# EAGLE design dynalo-dac (EAGLE 8.2.1)
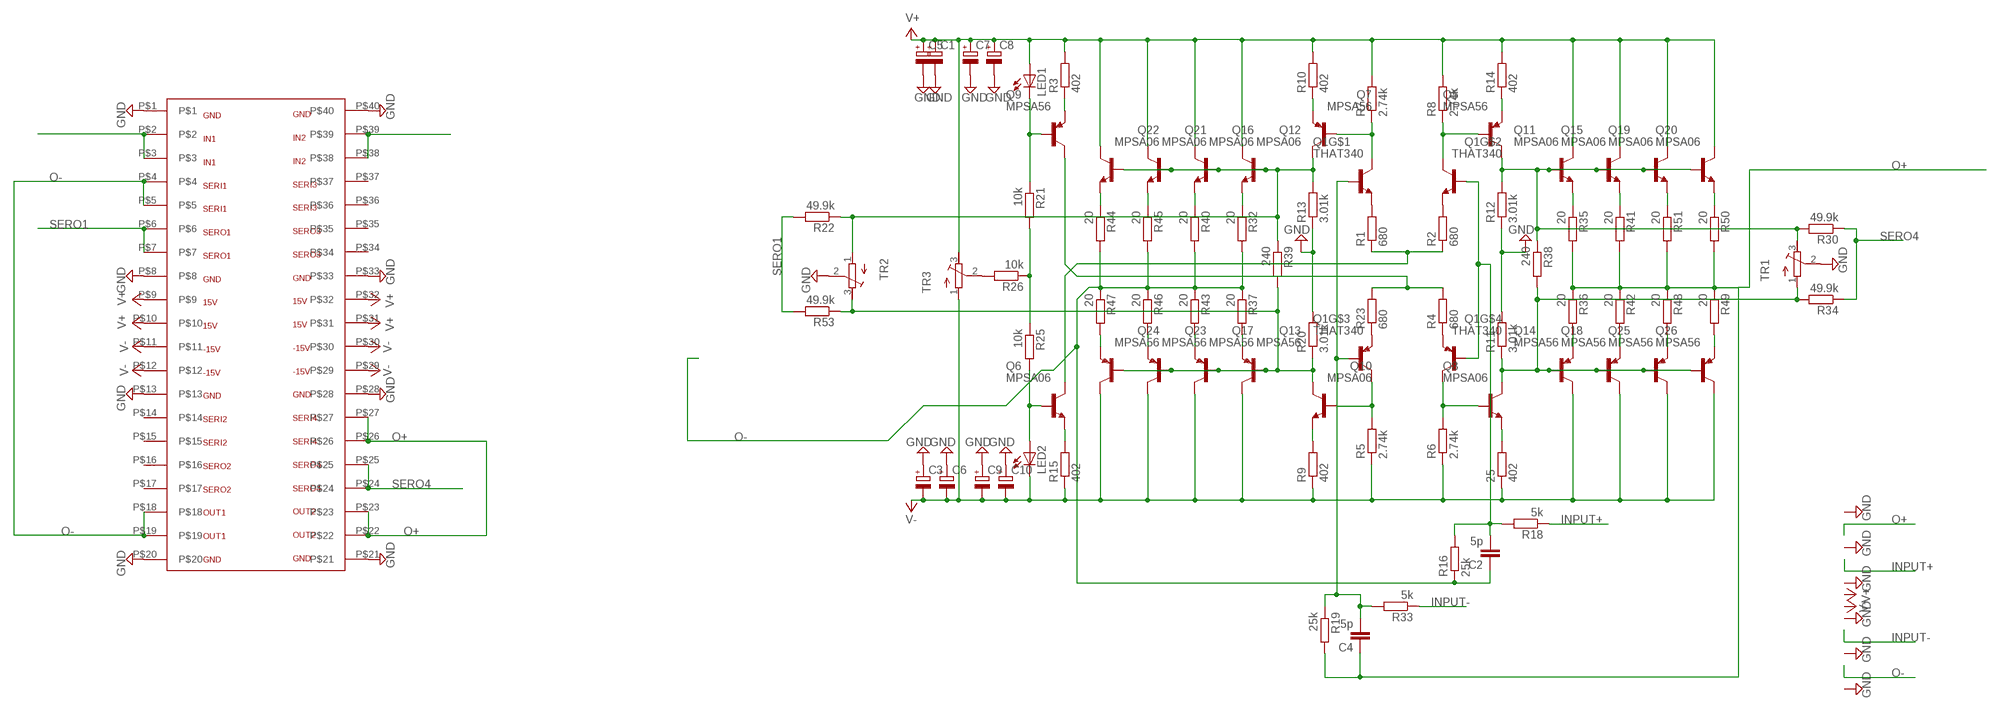
[diagram p0: schematic, sheet 1]

## Parts
25  402  R-EU_MELF0204W  [MINI_MELF-0204W]
C1  CPOL-EUSP-CAP-CX  [SP-CAP-CX]
C2  5p  C-EUC0805  [C0805]
C3  CPOL-EUSP-CAP-CX  [SP-CAP-CX]
C4  5p  C-EUC0805  [C0805]
C5  CPOL-EUSP-CAP-CX  [SP-CAP-CX]
C6  CPOL-EUSP-CAP-CX  [SP-CAP-CX]
C7  CPOL-EUSP-CAP-CX  [SP-CAP-CX]
C8  CPOL-EUSP-CAP-CX  [SP-CAP-CX]
C9  CPOL-EUSP-CAP-CX  [SP-CAP-CX]
C10  CPOL-EUSP-CAP-CX  [SP-CAP-CX]
LED1  LED5MM  [LED5MM]
LED2  LED5MM  [LED5MM]
Q1  THAT340  [DIP254P762X510-14]
Q5  MPSA56  [TO92-BCE]
Q6  MPSA06  [TO92-1]
Q7  MPSA56  [TO92-BCE]
Q8  MPSA06  [TO92-1]
Q9  MPSA56  [TO92-BCE]
Q10  MPSA06  [TO92-1]
Q11  MPSA06  [TO92-1]
Q12  MPSA06  [TO92-1]
Q13  MPSA56  [TO92-BCE]
Q14  MPSA56  [TO92-BCE]
Q15  MPSA06  [TO92-1]
Q16  MPSA06  [TO92-1]
Q17  MPSA56  [TO92-BCE]
Q18  MPSA56  [TO92-BCE]
Q19  MPSA06  [TO92-1]
Q20  MPSA06  [TO92-1]
Q21  MPSA06  [TO92-1]
Q22  MPSA06  [TO92-1]
Q23  MPSA56  [TO92-BCE]
Q24  MPSA56  [TO92-BCE]
Q25  MPSA56  [TO92-BCE]
Q26  MPSA56  [TO92-BCE]
R1  680  R-EU_MELF0204W  [MINI_MELF-0204W]
R2  680  R-EU_MELF0204W  [MINI_MELF-0204W]
R3  402  R-EU_MELF0204W  [MINI_MELF-0204W]
R4  680  R-EU_MELF0204W  [MINI_MELF-0204W]
R5  2.74k  R-EU_MELF0204W  [MINI_MELF-0204W]
R6  2.74k  R-EU_MELF0204W  [MINI_MELF-0204W]
R7  2.74k  R-EU_MELF0204W  [MINI_MELF-0204W]
R8  2.74k  R-EU_MELF0204W  [MINI_MELF-0204W]
R9  402  R-EU_MELF0204W  [MINI_MELF-0204W]
R10  402  R-EU_MELF0204W  [MINI_MELF-0204W]
R11  3.01k  R-EU_MELF0204W  [MINI_MELF-0204W]
R12  3.01k  R-EU_MELF0204W  [MINI_MELF-0204W]
R13  3.01k  R-EU_MELF0204W  [MINI_MELF-0204W]
R14  402  R-EU_MELF0204W  [MINI_MELF-0204W]
R15  402  R-EU_MELF0204W  [MINI_MELF-0204W]
R16  25k  R-EU_MELF0204W  [MINI_MELF-0204W]
R18  5k  R-EU_MELF0204W  [MINI_MELF-0204W]
R19  25k  R-EU_MELF0204W  [MINI_MELF-0204W]
R20  3.01k  R-EU_MELF0204W  [MINI_MELF-0204W]
R21  10k  R-EU_MELF0204W  [MINI_MELF-0204W]
R22  49.9k  R-EU_MELF0204W  [MINI_MELF-0204W]
R23  680  R-EU_MELF0204W  [MINI_MELF-0204W]
R25  10k  R-EU_MELF0204W  [MINI_MELF-0204W]
R26  10k  R-EU_MELF0204W  [MINI_MELF-0204W]
R30  49.9k  R-EU_MELF0204W  [MINI_MELF-0204W]
R32  20  R-EU_MELF0204W  [MINI_MELF-0204W]
R33  5k  R-EU_MELF0204W  [MINI_MELF-0204W]
R34  49.9k  R-EU_MELF0204W  [MINI_MELF-0204W]
R35  20  R-EU_MELF0204W  [MINI_MELF-0204W]
R36  20  R-EU_MELF0204W  [MINI_MELF-0204W]
R37  20  R-EU_MELF0204W  [MINI_MELF-0204W]
R38  240  R-EU_MELF0204W  [MINI_MELF-0204W]
R39  240  R-EU_MELF0204W  [MINI_MELF-0204W]
R40  20  R-EU_MELF0204W  [MINI_MELF-0204W]
R41  20  R-EU_MELF0204W  [MINI_MELF-0204W]
R42  20  R-EU_MELF0204W  [MINI_MELF-0204W]
R43  20  R-EU_MELF0204W  [MINI_MELF-0204W]
R44  20  R-EU_MELF0204W  [MINI_MELF-0204W]
R45  20  R-EU_MELF0204W  [MINI_MELF-0204W]
R46  20  R-EU_MELF0204W  [MINI_MELF-0204W]
R47  20  R-EU_MELF0204W  [MINI_MELF-0204W]
R48  20  R-EU_MELF0204W  [MINI_MELF-0204W]
R49  20  R-EU_MELF0204W  [MINI_MELF-0204W]
R50  20  R-EU_MELF0204W  [MINI_MELF-0204W]
R51  20  R-EU_MELF0204W  [MINI_MELF-0204W]
R53  49.9k  R-EU_MELF0204W  [MINI_MELF-0204W]
TR1  R-TRIMM3296W  [RTRIM3296W]
TR2  R-TRIMM3296W  [RTRIM3296W]
TR3  R-TRIMM3296W  [RTRIM3296W]
U$1  VDACA  [VDACA]

## Nets
GND: C1.- C3.+ C5.- C6.+ C7.- C8.- C9.+ C10.+ R11.2 R12.1 R13.1 R20.2 TR1.2(S) TR2.2(S) U$1.P$1 U$1.P$8 U$1.P$13 U$1.P$20 U$1.P$21 U$1.P$28 U$1.P$33 U$1.P$40
INPUT+: R18.1 U$1.P$38 U$1.P$39
INPUT-: R33.1 U$1.P$2 U$1.P$3
N$1: Q1.3(E) R1.2
N$2: Q1.12(E) R2.2
N$3: Q1.5(E) R23.1
N$4: Q1.10(E) R4.1
N$5: Q1.1(C) Q7.C(B) R7.1
N$6: Q1.14(C) Q5.C(B) R8.1
N$7: Q1.7(C) Q10.2(B) R5.2
N$8: Q1.8(C) Q8.2(B) R6.2
N$9: Q9.B(C) R4.2 R23.2
N$10: Q6.3(C) R1.1 R2.1
N$11: Q10.1(E) R9.2
N$12: Q7.E R10.1
N$15: C4.2 Q1.2(B) Q1.6(B) R19.1 R33.2
N$16: C2.2 Q1.9(B) Q1.13(B) R16.2 R18.2
N$17: Q7.B(C) Q12.2(B) Q16.2(B) Q21.2(B) Q22.2(B) R13.2 R22.1 R39.1 TR2.1(A)
N$18: Q10.3(C) Q13.C(B) Q17.C(B) Q23.C(B) Q24.C(B) R20.1 R39.2 R53.1 TR2.3(E)
N$21: Q11.1(E) R35.1
N$22: Q5.B(C) Q11.2(B) Q15.2(B) Q19.2(B) Q20.2(B) R12.2 R30.2 R38.1 TR1.3(E)
N$23: 25.2 Q8.1(E)
N$24: Q14.E R36.2
N$25: Q5.E R14.1
N$26: Q9.E R3.1
N$27: Q6.1(E) R15.2
N$28: Q18.E R42.2
N$29: Q15.1(E) R41.1
N$30: Q19.1(E) R51.1
N$31: Q20.1(E) R50.1
N$32: Q25.E R48.2
N$33: Q8.3(C) Q14.C(B) Q18.C(B) Q25.C(B) Q26.C(B) R11.1 R34.2 R38.2 TR1.1(A)
N$34: Q26.E R49.2
N$36: R26.2 TR3.2(S)
N$37: R21.2 R25.1 R26.1
N$39: Q22.1(E) R44.1
N$40: Q21.1(E) R45.1
N$41: Q16.1(E) R40.1
N$42: Q12.1(E) R32.1
N$43: Q24.E R47.2
N$44: Q23.E R46.2
N$45: Q17.E R43.2
N$46: Q13.E R37.2
N$48: LED2.A Q6.2(B) R25.2
N$49: LED1.K(C) Q9.C(B) R21.1
O+: C4.1 R19.2 R35.2 R36.1 R41.2 R42.1 R48.1 R49.1 R50.2 R51.2 U$1.P$22 U$1.P$23 U$1.P$26 U$1.P$27
O-: C2.1 R16.1 R32.2 R37.1 R40.2 R43.1 R44.2 R45.2 R46.1 R47.1 U$1.P$4 U$1.P$5 U$1.P$18 U$1.P$19
SERO1: R22.2 R53.2 U$1.P$6 U$1.P$7
SERO4: R30.1 R34.1 U$1.P$24 U$1.P$25
V+: C1.+ C5.+ C7.+ C8.+ LED1.A Q11.3(C) Q12.3(C) Q15.3(C) Q16.3(C) Q19.3(C) Q20.3(C) Q21.3(C) Q22.3(C) R3.2 R7.2 R8.2 R10.2 R14.2 TR3.3(E) U$1.P$9 U$1.P$10 U$1.P$31 U$1.P$32
V-: 25.1 C3.- C6.- C9.- C10.- LED2.K(C) Q13.B(C) Q14.B(C) Q17.B(C) Q18.B(C) Q23.B(C) Q24.B(C) Q25.B(C) Q26.B(C) R5.1 R6.1 R9.1 R15.1 TR3.1(A) U$1.P$11 U$1.P$12 U$1.P$29 U$1.P$30
Unconnected: U$1.P$14 U$1.P$15 U$1.P$16 U$1.P$17 U$1.P$34 U$1.P$35 U$1.P$36 U$1.P$37

## Library data of the parts
25 R1-R16 R18-R23 R25 R26 R30 R32-R51 R53 = Vwvwbg:R-EU_: RESISTOR, European symbol
C1 C3 C5-C10 = Vwvwbg:CPOL-EU: POLARIZED CAPACITOR, European symbol
C2 C4 = Vwvwbg:C-EU: CAPACITOR, European symbol
LED1 LED2 = led:LED: LED OSRAM: - CHIPLED LG R971, LG N971, LY N971, LG Q971, LY Q971, LO R971, LY R971 LH N974, LH R974 LS Q976, LO Q976, LY Q976 LO Q996 - Hyper CHIPLED LW Q18S LB Q993, LB Q99A, LB R99A - SideLED LS A670, LO A670, LY A670, LG A670, LP A670 LB A673, LV A673, LT A673, LW A673 LH A674 LY A675 LS A676, LA A676, LO A676, LY A676, LW A676 LS A679, LY A679, LG A679 - Hyper Micro SIDELED® LS Y876, LA Y876, LO Y876, LY Y876 LT Y87S - SmartLED LW L88C, LW L88S LB L89C, LB L89S, LG L890 LS L89K, LO L89K, LY L89K LS L896, LA L896, LO L896, LY L896 - TOPLED LS T670, LO T670, LY T670, LG T670, LP T670 LSG T670, LSP T670, LSY T670, LOP T670, LYG T670 LG T671, LOG T671, LSG T671 LB T673, LV T673, LT T673, LW T673 LH T674 LS T676, LA T676, LO T676, LY T676, LB T676, LH T676, LSB T676, LW T676 LB T67C, LV T67C, LT T67C, LS T67K, LO T67K, LY T67K, LW E67C LS E67B, LA E67B, LO E67B, LY E67B, LB E67C, LV E67C, LT E67C LW T67C LS T679, LY T679, LG T679 LS T770, LO T770, LY T770, LG T770, LP T770 LB T773, LV T773, LT T773, LW T773 LH T774 LS E675, LA E675, LY E675, LS T675 LS T776, LA T776, LO T776, LY T776, LB T776 LHGB T686 LT T68C, LB T68C - Hyper Mini TOPLED® LB M676 - Mini TOPLED Santana® LG M470 LS M47K, LO M47K, LY M47K Source: http://www.osram.convergy.de LUXEON: - LUMILED® LXK2-PW12-R00, LXK2-PW12-S00, LXK2-PW14-U00, LXK2-PW14-V00 LXK2-PM12-R00, LXK2-PM12-S00, LXK2-PM14-U00 LXK2-PE12-Q00, LXK2-PE12-R00, LXK2-PE12-S00, LXK2-PE14-T00, LXK2-PE14-U00 LXK2-PB12-K00, LXK2-PB12-L00, LXK2-PB12-M00, LXK2-PB14-N00, LXK2-PB14-P00, LXK2-PB14-Q00 LXK2-PR12-L00, LXK2-PR12-M00, LXK2-PR14-Q00, LXK2-PR14-R00 LXK2-PD12-Q00, LXK2-PD12-R00, LXK2-PD12-S00 LXK2-PH12-R00, LXK2-PH12-S00 LXK2-PL12-P00, LXK2-PL12-Q00, LXK2-PL12-R00 Source: www.luxeon.com KINGBRIGHT: KA-3528ASYC Source: www.kingbright.com
Q1 = transistor-arrays:THAT340
Q5 Q7 Q9 Q13 Q14 Q17 Q18 Q23-Q26 = tranzistory PNP:MPSA56*: PNP Transistror
Q6 Q8 Q10-Q12 Q15 Q16 Q19-Q22 = tranzistory NPN:MPSA06: NPN Transistor
TR1-TR3 = resistor:R-TRIMM: Trimm resistor
U$1 = Vwvwbg:VDACA

## Board
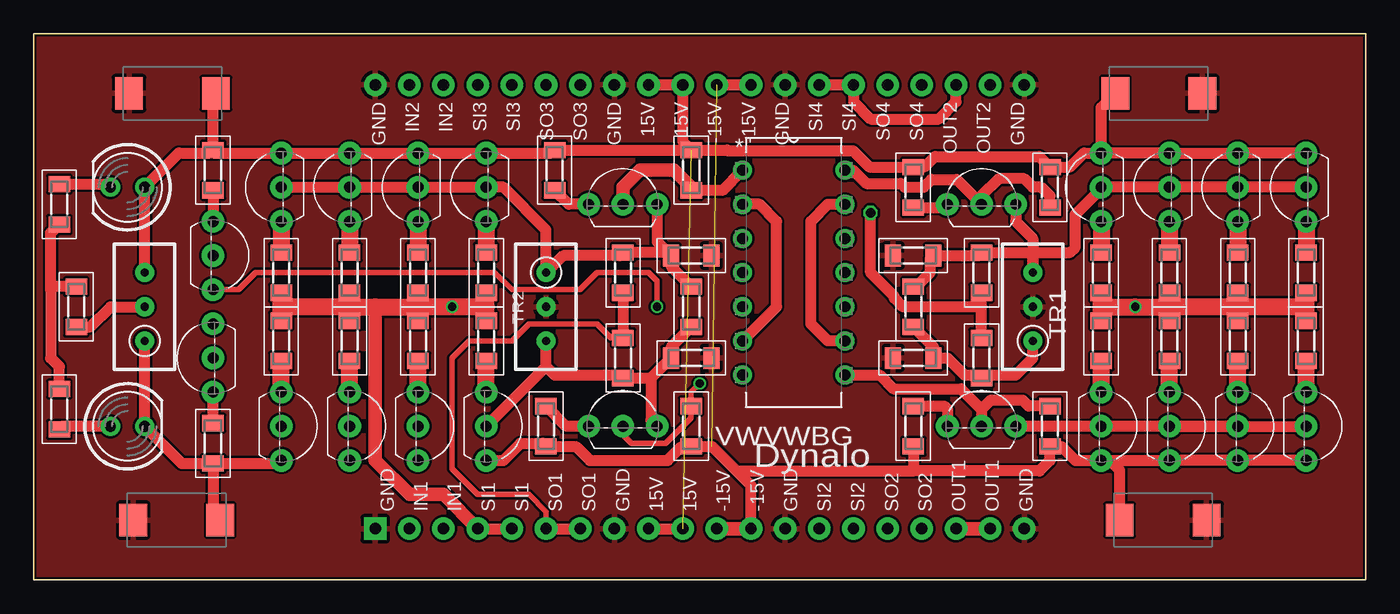
[diagram p1: board, top side]
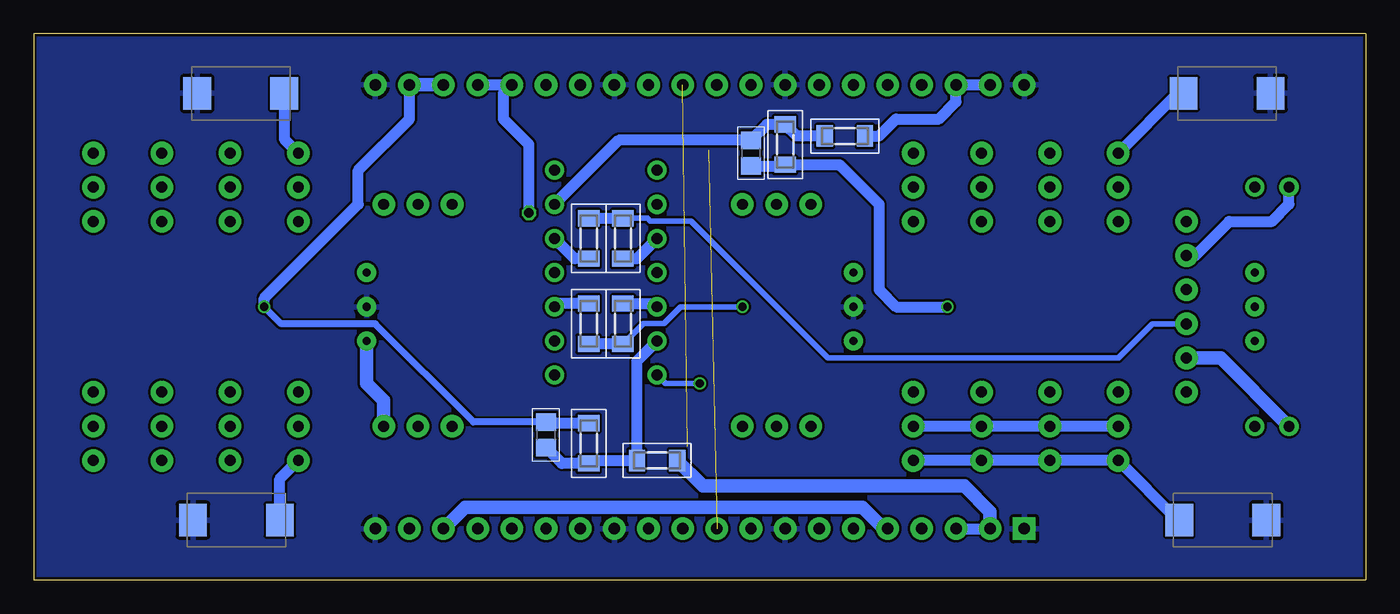
[diagram p2: board, bottom side, seen from below]

Size 99.06 x 40.64 mm. Coordinates in mm from the lower left corner, seen from the top.
Outline: 0,40.64 99.06,40.64 99.06,0 0,0 0,40.64
Copper layers (1*16): Top 0.035mm / dielectric 1.5mm / Bottom 0.035mm
Design rules "default": minimum track width 6mil, minimum drill 0.3mm, track to track 7mil, track to pad 7mil, pad to pad 7mil, via to via 7mil, smd to smd 7mil, copper to edge 8mil, drill to drill 8mil, minimum pad ring 6mil, minimum via ring 6mil, stop-mask expansion 4mil, vias tented up to drill 0mil, thermal gap 10mil

### Footprints (pad centres in the part's own frame; a part is rotated, then mirrored left to right if it is on the bottom)
MINI_MELF-0204W = smd 1.2 x 1.6: 1 -1.5,0; 2 1.5,0
SP-CAP-CX = smd 2.062 x 2.4: + -2.754,0; - 3.707,0
C0805 = smd 1.3 x 1.5: 1 -0.95,0; 2 0.95,0
LED5MM = drill 0.813 pad 1.422: A -1.27,0; K 1.27,0
DIP254P762X510-14 = drill 0.8 pad 1.422: 1 -7.62,15.24; 2 -7.62,12.7; 3 -7.62,10.16; 4 -7.62,7.62; 5 -7.62,5.08; 6 -7.62,2.54; 7 -7.62,0; 8 0,0; 9 0,2.54; 10 0,5.08; 11 0,7.62; 12 0,10.16; 13 0,12.7; 14 0,15.24
TO92-BCE = drill 0.813 pad 1.676: B 2.54,0; C 0,0; E -2.54,0
TO92-1 = drill 0.813 pad 1.676: 1 -2.54,0; 2 0,0; 3 2.54,0
RTRIM3296W = drill 0.61 pad 1.422: 1 0,-2.54; 2 0,0; 3 0,2.54
VDACA = drill 0.85 pad 1.676 square: P$1 1.27,-19.05 | drill 0.85 pad 1.676: P$2 1.27,-21.59; P$3 1.27,-24.13; P$4 1.27,-26.67; P$5 1.27,-29.21; P$6 1.27,-31.75; P$7 1.27,-34.29; P$8 1.27,-36.83; P$9 1.27,-39.37; P$10 1.27,-41.91; P$11 1.27,-44.45; P$12 1.27,-46.99; P$13 1.27,-49.53; P$14 1.27,-52.07; P$15 1.27,-54.61; P$16 1.27,-57.15; P$17 1.27,-59.69; P$18 1.27,-62.23; P$19 1.27,-64.77; P$20 1.27,-67.31; P$21 34.29,-67.31; P$22 34.29,-64.77; P$23 34.29,-62.23; P$24 34.29,-59.69; P$25 34.29,-57.15; P$26 34.29,-54.61; P$27 34.29,-52.07; P$28 34.29,-49.53; P$29 34.29,-46.99; P$30 34.29,-44.45; P$31 34.29,-41.91; P$32 34.29,-39.37; P$33 34.29,-36.83; P$34 34.29,-34.29; P$35 34.29,-31.75; P$36 34.29,-29.21; P$37 34.29,-26.67; P$38 34.29,-24.13; P$39 34.29,-21.59; P$40 34.29,-19.05

### Placement (x,y rotation side)
25  65.41,11.43 90 top
C1  83.19,36.2 0 top
C2  45.72,31.75 90 bottom
C3  84.45,4.45 180 top
C4  60.96,10.79 270 bottom
C5  10.79,36.2 180 top
C6  10.16,4.45 0 top
C7  10.79,36.2 0 bottom
C8  83.19,36.2 180 bottom
C9  10.16,4.45 180 bottom
C10  84.45,4.45 0 bottom
LED1  6.99,29.21 180 top
LED2  6.99,11.43 0 top
Q1  60.33,15.24 0 top
Q5  70.48,27.94 0 top
Q6  13.34,16.51 90 top
Q7  43.81,27.94 0 top
Q8  70.48,11.43 0 top
Q9  13.34,24.13 270 top
Q10  43.81,11.43 0 top
Q11  79.38,29.21 90 top
Q12  18.41,29.21 90 top
Q13  18.41,11.43 270 top
Q14  79.38,11.43 270 top
Q15  94.61,29.21 90 top
Q16  23.5,29.21 90 top
Q17  28.57,11.43 270 top
Q18  94.61,11.43 270 top
Q19  84.45,29.21 90 top
Q20  89.53,29.21 90 top
Q21  28.57,29.21 90 top
Q22  33.66,29.21 90 top
Q23  23.5,11.43 270 top
Q24  33.66,11.43 270 top
Q25  89.53,11.43 270 top
Q26  84.45,11.43 270 top
R1  55.24,25.4 270 bottom
R2  57.78,25.4 270 bottom
R3  13.34,30.48 90 top
R4  57.78,19.05 270 bottom
R5  48.9,11.43 90 top
R6  75.56,11.43 90 top
R7  48.9,30.48 90 top
R8  75.56,29.21 90 top
R9  38.1,11.43 90 top
R10  38.73,30.48 90 top
R11  65.41,16.51 180 top
R12  65.41,24.13 0 top
R13  48.9,24.13 180 top
R14  65.41,29.21 90 top
R15  13.34,10.16 90 top
R16  43.18,32.38 90 bottom
R18  38.73,33.02 180 bottom
R19  57.78,10.16 90 bottom
R20  48.9,16.51 0 top
R21  1.91,27.94 270 top
R22  43.81,22.86 270 top
R23  55.24,19.05 270 bottom
R25  1.91,12.7 270 top
R26  3.17,20.32 270 top
R30  70.48,22.86 90 top
R32  18.41,22.86 270 top
R33  52.7,8.89 180 bottom
R34  70.48,16.51 270 top
R35  79.38,22.86 270 top
R36  79.38,17.78 270 top
R37  18.41,17.78 270 top
R38  65.41,20.32 270 top
R39  48.9,20.32 270 top
R40  23.5,22.86 270 top
R41  94.61,22.86 270 top
R42  94.61,17.78 270 top
R43  28.57,17.78 270 top
R44  33.66,22.86 270 top
R45  28.57,22.86 270 top
R46  23.5,17.78 270 top
R47  33.66,17.78 270 top
R48  89.53,17.78 270 top
R49  84.45,17.78 270 top
R50  89.53,22.86 270 top
R51  84.45,22.86 270 top
R53  43.81,16.51 90 top
TR1  74.3,20.32 0 top
TR2  38.1,20.32 180 top
TR3  8.26,20.32 0 top
U$1  6.35,2.54 90 top

### Tracks (layer width: path | path; a pad name or v marks a point on that pad's centre or on a via)
GND
  pour Top: -3.17,43.18 100.97,43.18 100.97,-2.54 -3.17,-2.54
  pour Bottom: -3.17,43.18 100.97,43.18 100.97,-6.35 -3.17,-6.35
INPUT+
  Bottom 0.813: R18.1 36.2,33.02 34.92,34.29 31.75,34.29 30.48,35.56 U$1.P$38 U$1.P$39
INPUT-
  Bottom 0.813: U$1.P$3 U$1.P$2
  Bottom 1.016: U$1.P$2 27.94,5.08 29.84,6.99 49.3,6.99 R33.1
N$1
  Bottom 0.813: R1.2 54.2,23.9 Q1.3
N$2
  Bottom 0.813: R2.2 58.83,23.9 Q1.12
N$3
  Bottom 0.813: R23.1 52.94,20.55 Q1.5
N$4
  Bottom 0.813: R4.1 60.09,20.55 Q1.10
N$5
  Top 0.813: R7.1 51.2,28.98 Q1.1
  Top 1.016: R7.1 48.9,29.21 47.62,30.48 45.09,30.48 43.81,29.21 Q7.C
N$6
  Top 0.813: Q1.14 60.94,30.48 61.91,29.5 64.48,29.5 64.77,29.21 66.17,29.21 66.74,29.78 68.64,29.78 Q5.C 70.48,28.57 71.75,29.84 73.66,29.84 74.3,29.21 74.93,29.21 75.56,28.57 R8.1
N$7  (via drill 0.6)
  Top 0.406: v49.53,14.61 48.9,13.97 R5.2 48.9,12.06 46.99,10.16 44.45,10.16 43.81,10.79 Q10.2
  Bottom 0.406: v49.53,14.61 52.07,14.61 Q1.7
N$8
  Top 0.813: Q1.8 62.91,15.24 63.93,14.22 68.96,14.22 70.48,12.7 | 70.48,12.7 Q8.2 | R6.2 73.98,12.93 73.55,13.36 71.14,13.36 70.48,12.7
N$9  (via drill 0.6)
  Top 0.406: v46.35,20.32 46.35,22.23 45.72,22.86 41.91,22.86 40.64,21.59 35.56,21.59 34.29,22.86 16.51,22.86 15.24,21.59 Q9.B
  Bottom 0.406: v46.35,20.32 50.95,20.32 52.19,19.07 53.72,19.07 R23.2
  Bottom 0.813: R23.2 R4.2
N$10
  Bottom 0.406: R1.1 53.42,26.9 53.22,26.7 50.19,26.7 40.01,16.51 18.41,16.51 15.88,19.05 Q6.3
  Bottom 0.813: R2.1 R1.1
N$11
  Top 0.813: Q10.1 39.6,11.43 R9.2
N$12
  Top 0.813: Q7.E 39.77,27.94 R10.1
N$15
  Top 0.813: Q1.6 55.24,20.32 55.24,26.67 53.98,27.94 Q1.2
  Bottom 0.813: C4.2 59.77,8.66 R19.1 57.55,8.89 R33.2 54.2,16.28 Q1.6
N$16
  Top 0.813: Q1.9 59.05,17.78 57.78,19.05 57.78,26.67 59.05,27.94 Q1.13
  Bottom 0.813: R18.2 42.31,33.02 R16.2 44.53,33.88 C2.2 55.56,32.7 Q1.13
N$17
  Top 0.813: 47.16,24.36 R22.1 43.59,24.13 39.37,24.13 TR2.1 38.1,26.04 34.92,29.21 Q22.2 Q21.2 Q16.2 Q12.2 | 47.16,24.36 R13.2 47.4,23.32 R39.1 | Q7.B 46.35,25.17 47.16,24.36
N$18
  Top 0.813: 45.9,15.01 R53.1 43.59,15.24 38.73,15.24 38.1,15.88 | 45.9,15.01 R20.1 47.4,17.32 R39.2 | 45.9,15.01 45.9,11.89 Q10.3 | 38.1,15.88 TR2.3 | Q24.C 38.1,15.88
  Bottom 0.813: Q13.C Q23.C Q17.C Q24.C
N$21
  Top 1.27: Q11.1 R35.1
N$22
  Top 0.813: Q15.2 Q20.2 Q19.2 Q11.2 79.38,29.13 77.44,27.2 77.44,24.74 77.06,24.36 74.06,24.36 | R38.1 65.64,21.82 66.67,22.86 66.67,23.9 R12.2 70.25,24.13 R30.2 74.06,24.36 | 74.06,24.36 74.3,24.13 TR1.3 74.3,25.4 73.03,26.67 Q5.B
N$23
  Top 0.813: 25.2 67.72,12.93 67.94,12.7 Q8.1
N$24
  Top 1.27: Q14.E R36.2
N$25
  Top 0.813: R14.1 67.72,27.71 Q5.E
N$26
  Top 0.813: R3.1 Q9.E
N$27
  Top 0.813: R15.2 Q6.1
N$28
  Top 1.27: Q18.E R42.2
N$29
  Top 1.27: Q15.1 R41.1
N$30
  Top 1.27: Q19.1 R51.1
N$31
  Top 1.27: Q20.1 R50.1
N$32
  Top 1.27: Q25.E R48.2
N$33
  Top 0.813: Q25.C Q18.C | Q25.C Q14.C Q8.3 | R38.2 66.91,17.32 R11.1 67.94,16.51 69.22,15.24 70.25,15.24 R34.2 70.72,15.24 73.03,15.24 74.3,16.51 TR1.1 | Q26.C Q25.C
  Bottom 1.016: Q8.3 73.03,13.34 74.3,14.61 TR1.1
N$34
  Top 1.27: Q26.E R49.2
N$36
  Top 0.813: R26.2 4.21,18.82 5.71,20.32 TR3.2
N$37
  Top 0.813: R25.1 1.91,15.88 1.27,16.51 1.27,21.59 | 1.27,21.59 1.27,25.8 R21.2 | R26.1 1.5,21.82 1.27,21.59
N$39
  Top 1.27: Q22.1 R44.1
N$40
  Top 1.27: Q21.1 R45.1
N$41
  Top 1.27: Q16.1 R40.1
N$42
  Top 1.27: Q12.1 R32.1
N$43
  Top 1.27: Q24.E R47.2
N$44
  Top 1.27: Q23.E R46.2
N$45
  Top 1.27: Q17.E R43.2
N$46
  Top 1.27: Q13.E R37.2
N$48
  Top 0.813: LED2.A 2.13,11.43 R25.2
  Bottom 1.016: Q6.2 10.79,16.51 LED2.A
N$49
  Top 0.813: R21.1 5.49,29.44 LED1.K
  Bottom 0.813: Q9.C 12.7,24.13 10.16,26.67 6.99,26.67 5.71,27.94 LED1.K
O+  (via drill 0.6)
  Top 0.813: U$1.P$27 U$1.P$26 60.96,35.56 62.23,34.29 67.31,34.29 68.58,35.56 U$1.P$23
  Top 1.27: R36.1 79.38,20.32 | 79.38,20.32 R35.2 | R51.2 84.45,20.32 | 84.45,20.32 R49.1 | R50.2 89.53,20.32 | 89.53,20.32 R48.1 | R42.1 94.61,20.32 | 94.61,20.32 R41.2 | 94.61,20.32 89.53,20.32 | 89.53,20.32 84.45,20.32 | 84.45,20.32 v81.92,20.32 79.38,20.32
  Bottom 0.508: C4.1 66.36,11.74 73.66,19.05 80.64,19.05 v81.92,20.32
  Bottom 0.813: R19.2 60.88,11.66 C4.1 | v81.92,20.32 81.92,20.95 74.93,27.94 74.93,30.48 71.12,34.29 U$1.P$22
  Bottom 1.016: U$1.P$22 U$1.P$23
O-  (via drill 0.6)
  Top 0.813: U$1.P$4 U$1.P$5
  Top 1.016: U$1.P$19 U$1.P$18 | 25.4,20.32 25.4,8.89 27.94,6.35 30.48,6.35 U$1.P$4
  Top 1.27: 18.41,20.32 R32.2 | 33.66,20.32 v31.11,20.32 28.57,20.32 | 23.5,20.32 25.4,20.32 28.57,20.32 | 23.5,20.32 18.41,20.32 | 33.66,20.32 R44.2 | R43.1 28.57,20.32 | R45.2 28.57,20.32 | R40.2 23.5,20.32 | R46.1 23.5,20.32 | R37.1 18.41,20.32 | R47.1 33.66,20.32
  Bottom 0.813: C2.1 43.27,30.8 R16.1 39.14,30.89 36.2,27.94 36.2,21.59 34.92,20.32 v31.11,20.32
  Bottom 1.016: U$1.P$5 35.84,3.81 37.44,5.41 66.98,5.41 U$1.P$18
SERO1
  Top 0.406: R53.2 42.95,18.01 41.91,19.05 36.83,19.05 35.56,17.78 32.38,17.78 31.11,16.51 31.11,8.26 33.02,6.35 36.83,6.35 38.1,5.08 U$1.P$6
  Top 0.813: R22.2 R53.2 | U$1.P$6 U$1.P$7
SERO4  (via drill 0.7)
  Top 0.813: R34.1 70.48,20.32 | 70.48,20.32 R30.1 70.48,21.59 | 70.48,20.32 64.64,20.32 63.99,20.97 63.99,21.09 62.23,22.86 v62.23,27.3
  Bottom 0.813: v62.23,27.3 62.23,32.38 64.14,34.29 64.14,36.2 U$1.P$25 U$1.P$24
V+  (1 unrouted)
  Top 0.254: R14.2 65.59,31 65.59,30.71
  Top 0.813: R3.2 13.34,31.75 Q12.3 Q16.3 Q21.3 Q22.3 38.51,31.75 R10.2 R7.2 | Q11.3 Q19.3 Q20.3 Q15.3 | TR3.3 LED1.A 10.79,31.75 13.11,31.75 R3.2 | Q11.3 78.11,31.75 77.06,30.71 R8.2 74.78,31.5 67.02,31.5 66.23,30.71 65.59,30.71 R14.2 62.14,30.71 60.92,31.93 51.61,31.93 51.56,31.98 R7.2 | U$1.P$32 U$1.P$31 48.26,32.62 R7.2 | U$1.P$9 U$1.P$10 | R3.2 13.34,35.98 C7.+ | Q11.3 79.38,35.14 C8.+
  Bottom 0.813: C7.+ 13.97,36.2 Q12.3 | C8.+ 80.43,32.81 Q11.3
V-  (1 unrouted)
  Top 0.813: R15.1 11.03,8.66 LED2.K | LED2.K TR3.1 | Q18.B Q25.B Q26.B 80.01,8.89 | 80.01,8.89 Q14.B 77.47,8.89 76.43,9.93 R6.1 75.56,8.89 74.79,8.11 65.41,8.11 | 52.26,8.11 65.41,8.11 | 52.26,8.11 50.44,9.93 R5.1 48.17,9.93 47.13,8.89 41.36,8.89 40.32,9.93 R9.1 37.87,10.16 36.2,10.16 34.92,8.89 Q24.B | 8.29,11.39 LED2.K | U$1.P$12 53.34,7.03 52.26,8.11 | 25.1 65.41,8.11 | U$1.P$30 U$1.P$29 | R15.1 18.18,8.66 Q13.B | R15.1 13.34,4.98 C9.- | C10.- 80.75,8.15 80.01,8.89
  Top 1.016: U$1.P$11 U$1.P$12
  Bottom 0.813: Q24.B Q17.B Q23.B Q13.B 13.97,4.45 C9.- | C10.- 80.75,7.52 Q14.B

### Text on the board
tPlace: Dynalo
tNames: VWVWBG